# EAGLE design 4port (EAGLE 7.6.0)
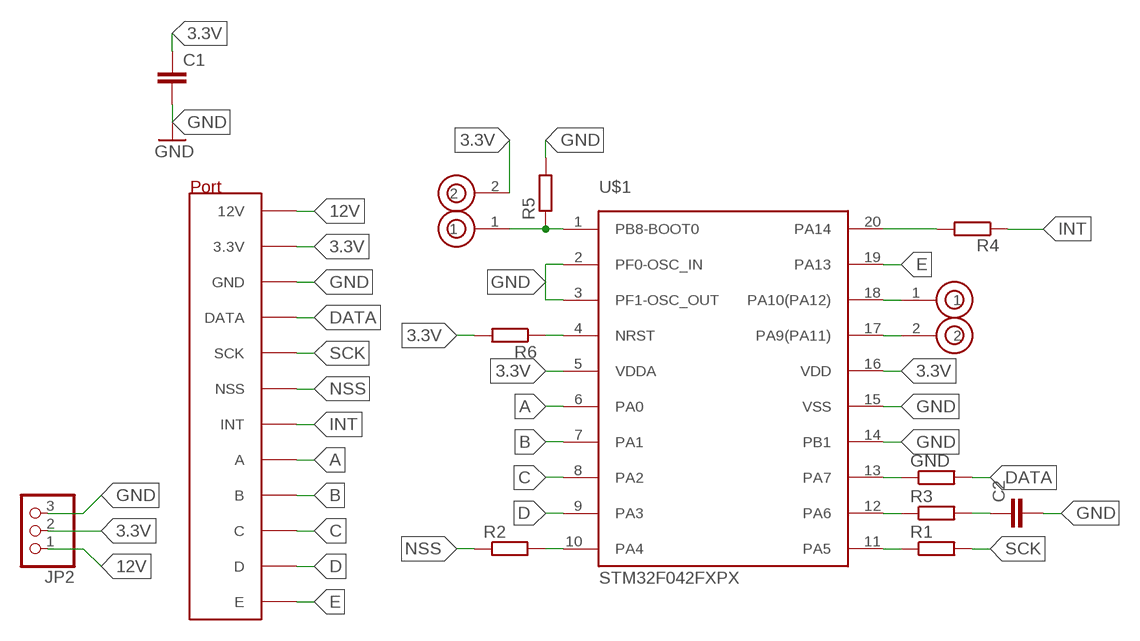
[diagram p0: schematic, sheet 1]

## Parts
C1  C-EUC1206  [C1206]
C2  C-EUC1206  [C1206]
GND  R-EU_R0603  [R0603]
JP2  PINHD-1X3  [1X03]
R1  R-EU_R0603  [R0603]
R2  R-EU_R0603  [R0603]
R3  R-EU_R0603  [R0603]
R4  R-EU_R0603  [R0603]
R5  R-EU_R0603  [R0603]
R6  R-EU_R0603  [R0603]
U$1  STM32F042FXPX  [TSSOP20]
U$2  GOLDPIN_2  [GOLDPIN_2_SMD]
U$3  GOLDPIN_2  [GOLDPIN_2_SMD]
U$4  HUB_PORT  [HUB_PORT]

## Nets
3.3V: C1.1 JP2.2 R6.2 U$1.5(VDDA) U$1.16(VDD) U$2.2 U$4.3.3V
12V: JP2.1 U$4.12V
A: U$1.6(PA0) U$4.A
B: U$1.7(PA1) U$4.B
C: U$1.8(PA2) U$4.C
D: U$1.9(PA3) U$4.D
DATA: GND.2 U$4.DATA
E: U$1.19(PA13) U$4.E
GND: C1.2 C2.2 JP2.3 R5.2 U$1.2(PF0-OSC_IN) U$1.3(PF1-OSC_OUT) U$1.14(PB1) U$1.15(VSS) U$4.GND
INT: R4.1 U$4.INT
N$1: C2.1 R3.2
N$5: GND.1 U$1.13(PA7)
N$6: R3.1 U$1.12(PA6)
N$7: R1.1 U$1.11(PA5)
N$8: R2.2 U$1.10(PA4)
N$13: R6.1 U$1.4(NRST)
N$14: R5.1 U$1.1(PB8-BOOT0) U$2.1
N$17: U$1.18(PA10(PA12)) U$3.1
N$18: U$1.17(PA9(PA11)) U$3.2
N$28: R4.2 U$1.20(PA14)
NSS: R2.1 U$4.NSS
SCK: R1.2 U$4.SCK

## Library data of the parts
C1 C2 = resistor:C-EU: CAPACITOR, European symbol
GND R1-R6 = resistor:R-EU_: RESISTOR, European symbol
JP2 = pinhead:PINHD-1X3: PIN HEADER
U$1 = stm32f0:STM32F042FXPX
U$2 U$3 = gumyns:GOLDPIN_2
U$4 = gumyns:HUB_PORT

## Board
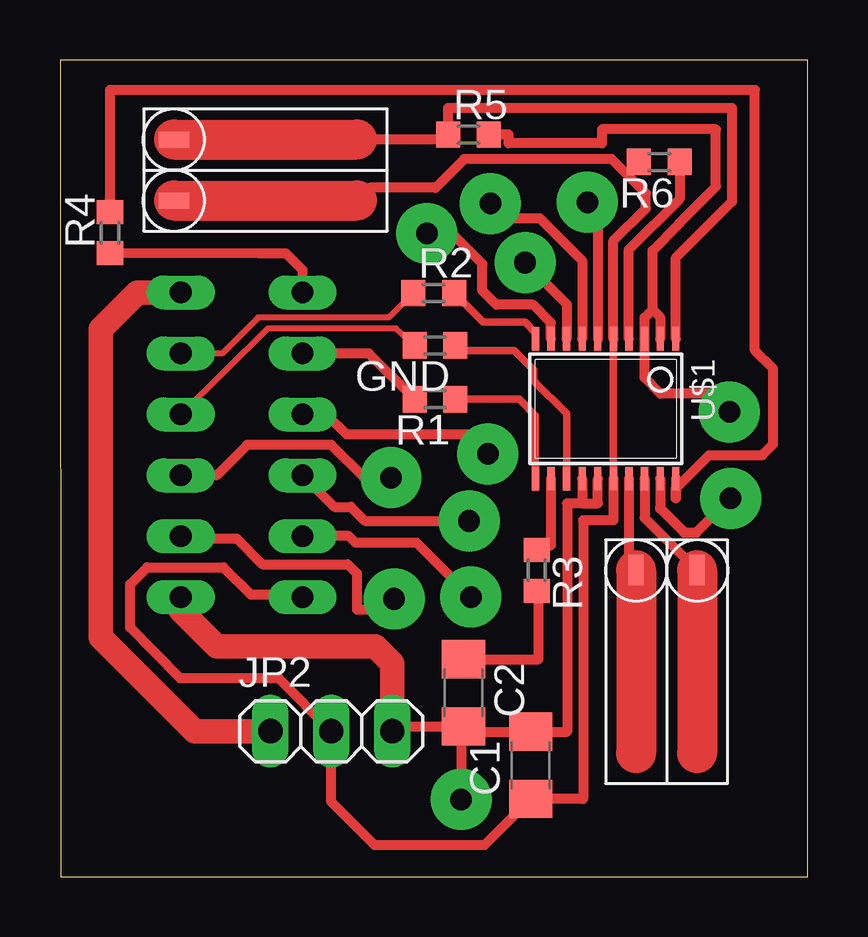
[diagram p1: board, top side]
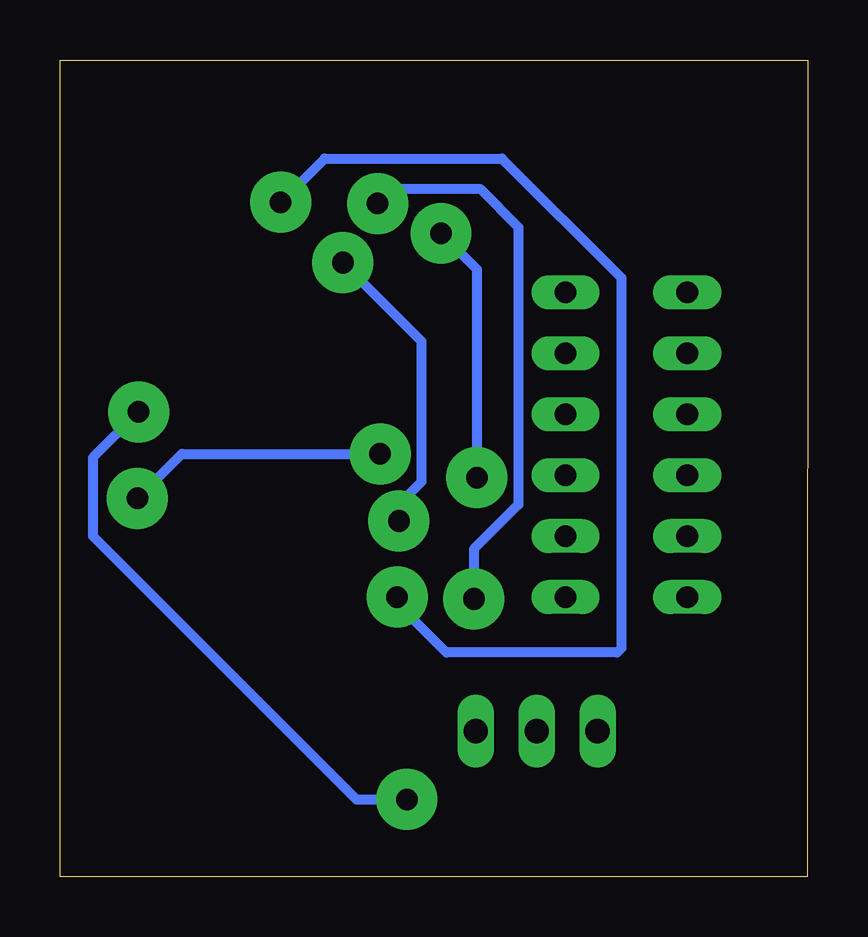
[diagram p2: board, bottom side, seen from below]

Size 31.17 x 34.05 mm. Coordinates in mm from the lower left corner, seen from the top.
Outline: 0.03,0 31.17,0 31.17,34.05 0,34.05 0.03,0
Copper layers (1*16): Top 0.035mm / dielectric 1.5mm / Bottom 0.035mm
Design rules "default": minimum track width 10mil, minimum drill 24mil, track to track 8mil, track to pad 8mil, pad to pad 8mil, via to via 8mil, smd to smd 8mil, copper to edge 40mil, drill to drill 8mil, minimum pad ring 10mil, minimum via ring 8mil, stop-mask expansion 4mil, vias tented up to drill 0mil, thermal gap 10mil

### Footprints (pad centres in the part's own frame; a part is rotated, then mirrored left to right if it is on the bottom)
C1206 = smd 1.6 x 1.8: 1 -1.4,0; 2 1.4,0
R0603 = smd 1 x 1.1: 1 -0.85,0; 2 0.85,0
1X03 = drill 1.016 long: 1 -2.54,0; 2 0,0; 3 2.54,0
TSSOP20 = smd 0.305 x 0.991: 1 -2.925,-2.918; 2 -2.275,-2.918; 3 -1.625,-2.918; 4 -0.975,-2.918; 5 -0.325,-2.918; 6 0.325,-2.918; 7 0.975,-2.918; 8 1.625,-2.918; 9 2.275,-2.918; 10 2.925,-2.918; 11 2.925,2.918; 12 2.275,2.918; 13 1.625,2.918; 14 0.975,2.918; 15 0.325,2.918; 16 -0.325,2.918; 17 -0.975,2.918; 18 -1.625,2.918; 19 -2.275,2.918; 20 -2.925,2.918
GOLDPIN_2_SMD = smd 0.66 x 1.27: 1 -1.27,1.27; 2 1.27,1.27
HUB_PORT = drill 0.9 pad 1.422 long: 3.3V -2.54,2.54; 12V 10.16,-2.54; A 0,2.54; B 0,-2.54; C 2.54,2.54; D 2.54,-2.54; DATA 5.08,-2.54; E 5.08,2.54; GND -2.54,-2.54; INT 10.16,2.54; NSS 7.62,-2.54; SCK 7.62,2.54

### Placement (x,y rotation side)
C1  19.61,4.65 90 top
C2  16.81,7.67 270 top
GND  15.62,22.15 180 top
JP2  11.3,6.07 0 top
R1  15.62,19.91 180 top
R2  15.57,24.33 0 top
R3  19.86,12.78 270 top
R4  2.08,26.85 90 top
R5  17.02,30.94 0 top
R6  24.97,29.79 180 top
U$1  22.73,19.51 180 top
U$2  3.48,29.46 270 top
U$3  25.27,14.05 180 top
U$4  7.57,14.2 90 bottom

### Tracks (layer width: path | path; a pad name or v marks a point on that pad's centre or on a via)
3.3V
  Top 0.305: U$1.16 U$1.5
  Top 0.406: U$4.3.3V 10.01,11.76 7.95,11.76 6.81,12.9 3.63,12.9 2.92,12.19 2.92,10.39 5,8.28 9.12,8.28 JP2.2 11.3,3.12 13.11,1.32 17.68,1.32 C1.1 21.79,3.25 21.79,14.86 23.06,14.86 U$1.16 | U$1.5 23.06,26.51 24.41,27.86 24.41,28.5 23.61,29.3 | 23.61,29.3 22.99,29.92 16.84,29.92 15.65,28.73 12.9,28.73 12.37,28.19 | R6.2 24.1,29.79 23.61,29.3
12V
  Top 1.016: JP2.1 5.61,6.07 1.7,9.98 1.7,22.83 3.23,24.36 U$4.12V
A  (via drill 0.9 pad 2.54)
  Top 0.406: v17.12,11.66 14.86,13.92 12.32,13.92 12.04,14.2 U$4.A | v21.97,28.12 22.41,27.68 U$1.6
  Bottom 0.406: v21.97,28.12 20.14,29.95 12.75,29.95 7.77,24.97 7.77,9.53 7.95,9.35 15.06,9.35 17.12,11.4 v17.12,11.66
B  (via drill 0.9 pad 2.54)
  Top 0.406: U$4.B 5.13,14.1 7.37,14.1 8.43,13.03 11.99,13.03 12.37,12.65 12.37,11.13 13.46,11.13 v13.92,11.58 | v17.93,28.07 18.54,27.46 19.99,27.46 21.76,25.69 U$1.7
  Bottom 0.406: v17.93,28.07 17.32,28.68 13.67,28.68 12.07,27.08 12.07,15.52 13.92,13.67 v13.92,11.58
C  (via drill 0.9 pad 2.54)
  Top 0.406: U$4.C 11.43,15.42 12.12,15.42 12.7,14.83 v17.04,14.83 | v19.38,25.6 21.11,23.88 U$1.8
  Bottom 0.406: v19.38,25.6 16.1,22.33 16.1,16.46 17.04,15.52 v17.04,14.83
D  (via drill 0.9 pad 2.54)
  Top 0.406: v13.79,16.64 12.67,16.64 11.3,18.01 7.8,18.01 6.53,16.74 U$4.D | U$1.9 20.46,23.1 19.71,23.85 18.19,23.85 17.6,24.43 17.6,25.55 16.33,26.82 v15.29,26.82
  Bottom 0.406: v15.29,26.82 13.79,25.32 v13.79,16.64
DATA
  Top 0.254: GND.2 14.01,22.86 8.66,22.86 U$4.DATA
E  (via drill 0.9 pad 2.54)
  Top 0.406: 26.01,14.38 25.01,15.38 U$1.19 25.01,15.35 26.01,14.35 26.52,14.35 v27.94,15.77 | v17.83,17.63 17.02,18.44 11.94,18.44 11.1,19.28 U$4.E
  Bottom 0.406: v27.94,15.77 26.09,17.63 v17.83,17.63
GND  (via drill 0.9 pad 2.54)
  Top 0.406: U$1.14 21.76,15.57 | 21.76,15.57 22.41,15.57 U$1.15 | 21.76,15.57 21.13,15.57 21.13,6.05 C1.2 17.04,6.05 | JP2.3 14.04,6.27 C2.2 17.04,6.05 | 24.69,23.65 24.36,23.32 U$1.3 24.36,20.8 25.02,20.14 27.13,20.14 v27.89,19.38 | 24.69,23.65 25.01,23.33 U$1.2 | 24.69,23.65 24.69,26.11 25.81,27.23 25.81,27.25 27.33,28.78 27.33,31.17 22.58,31.17 22.58,30.58 18.69,30.58 18.69,30.94 R5.2 | 17.04,6.05 16.71,6.05 v16.71,3.23
  Top 1.016: JP2.3 13.84,8.89 13.13,9.6 6.53,9.6 5.03,11.1 U$4.GND
  Bottom 0.406: v27.89,19.38 29.79,17.48 29.79,14.2 18.82,3.23 v16.71,3.23
INT
  Top 0.406: U$4.INT 10.11,25.3 9.42,25.98 8.29,25.98 R4.1
N$1
  Top 0.406: C2.1 19.94,9.07 19.94,11.8 R3.2
N$5
  Top 0.305: GND.1 16.67,21.95 18.92,21.95 19.74,21.13 19.74,20.68 21.11,19.3 U$1.13
N$6
  Top 0.406: U$1.12 20.46,13.82 R3.1
N$7
  Top 0.305: R1.1 19.13,19.91 19.81,19.23 U$1.11
N$8
  Top 0.305: R2.2 17.64,23.11 19.38,23.11 19.81,22.69 U$1.10
N$13
  Top 0.406: U$1.4 23.71,26.15 25.82,28.26 R6.1
N$14
  Top 0.406: U$1.1 25.66,25.81 27.99,28.14 27.99,32.05 16.17,32.05 R5.1 16.17,30.73 12.37,30.73
N$17
  Top 0.406: U$1.18 24.36,14.96 U$3.1
N$18
  Top 0.406: U$1.17 23.71,13.07 U$3.2
N$28
  Top 0.406: U$1.20 25.66,15.78 25.65,15.77 25.65,16.18 27.05,17.58 29.26,17.58 29.72,18.03 29.72,21.18 28.96,21.95 28.96,32.79 2.08,32.79 R4.2
NSS
  Top 0.254: R2.1 13.7,23.32 8.26,23.32 6.76,21.82 U$4.NSS
SCK
  Top 0.406: R1.2 12.87,21.82 U$4.SCK